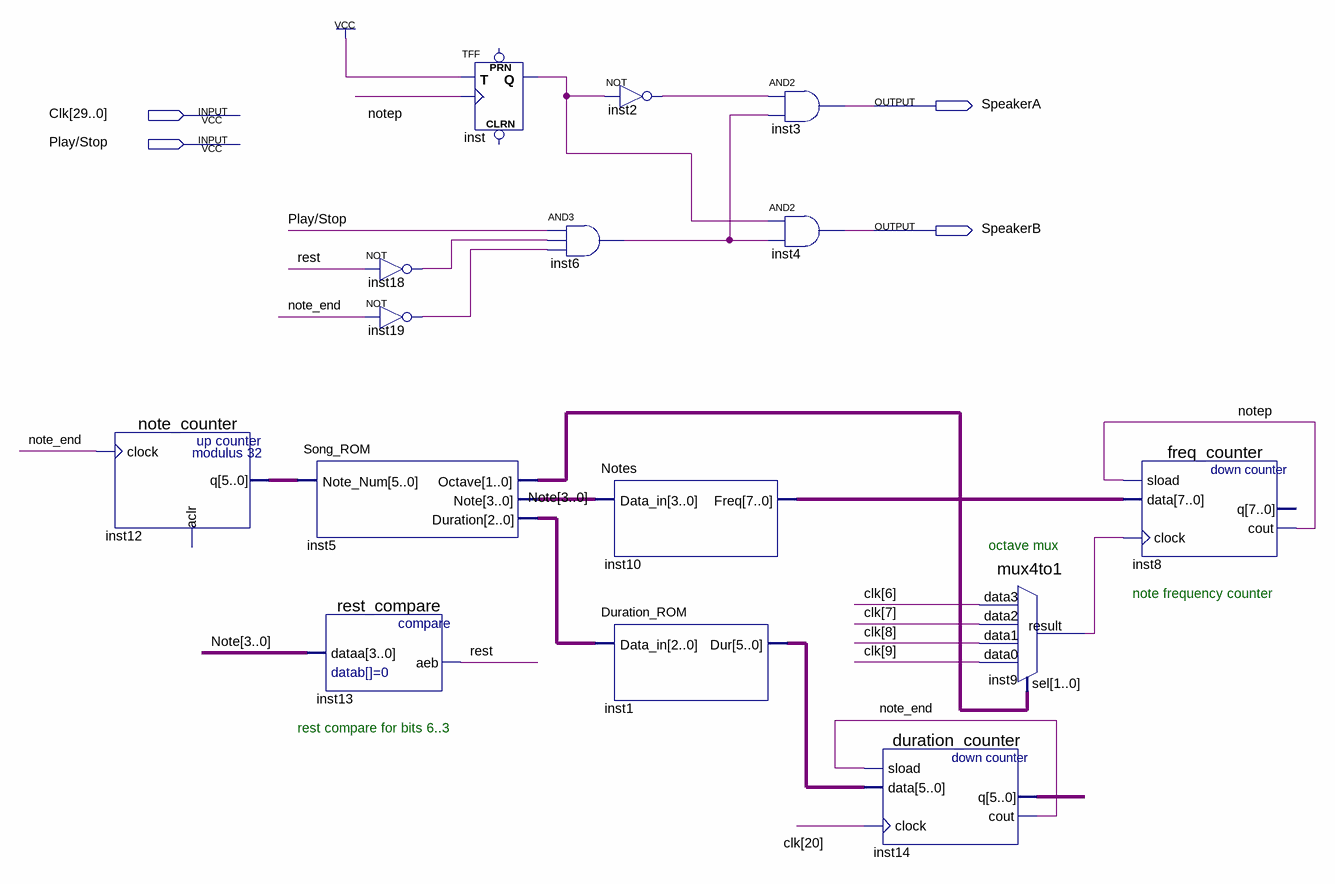
[diagram p0: schematic sheet]
// Quartus schematic MusicSynth.bdf as structural Verilog: 15 symbols, 4 pins
module MusicSynth (
  input  [29:0] Clk,
  input  \Play/Stop ,
  output SpeakerA,
  output SpeakerB
);

  wire inst2_out, inst6_out, inst9_result, inst18_out, inst19_out, inst_q, note_end, notep, rest;
  wire [1:0] inst5_octave;
  wire [2:0] inst5_duration;
  wire [3:0] Note;
  wire [5:0] inst1_dur, inst12_q, inst14_q;
  wire [7:0] inst10_freq;

  note_counter inst12 (.clock(note_end), .q(inst12_q));  // open: aclr
  Song_ROM inst5 (.Note_Num(inst12_q), .Octave(inst5_octave), .Note(Note), .Duration(inst5_duration));
  rest_compare inst13 (.dataa(Note), .aeb(rest));
  not inst18 (inst18_out, rest);
  not inst19 (inst19_out, note_end);
  TFF inst (.T(1'b1), .CLK(notep), .Q(inst_q));  // open: PRN, CLRN
  and inst6 (inst6_out, \Play/Stop , inst18_out, inst19_out);
  not inst2 (inst2_out, inst_q);
  Notes inst10 (.Data_in(Note), .Freq(inst10_freq));
  Duration_ROM inst1 (.Data_in(inst5_duration), .Dur(inst1_dur));
  and inst3 (SpeakerA, inst2_out, inst6_out);
  and inst4 (SpeakerB, inst_q, inst6_out);
  duration_counter inst14 (.sload(note_end), .data(inst1_dur), .clock(Clk[20]), .q(inst14_q), .cout(note_end));
  mux4to1 inst9 (
    .data3(Clk[6]), .data2(Clk[7]), .data1(Clk[8]), .data0(Clk[9]), .sel(inst5_octave), .result(inst9_result));
  freq_counter inst8 (.sload(notep), .data(inst10_freq), .clock(inst9_result), .cout(notep));  // open: q

  // Notes on the sheet:
  //   octave mux
  //   note frequency counter
  //   rest compare for bits 6..3
endmodule
